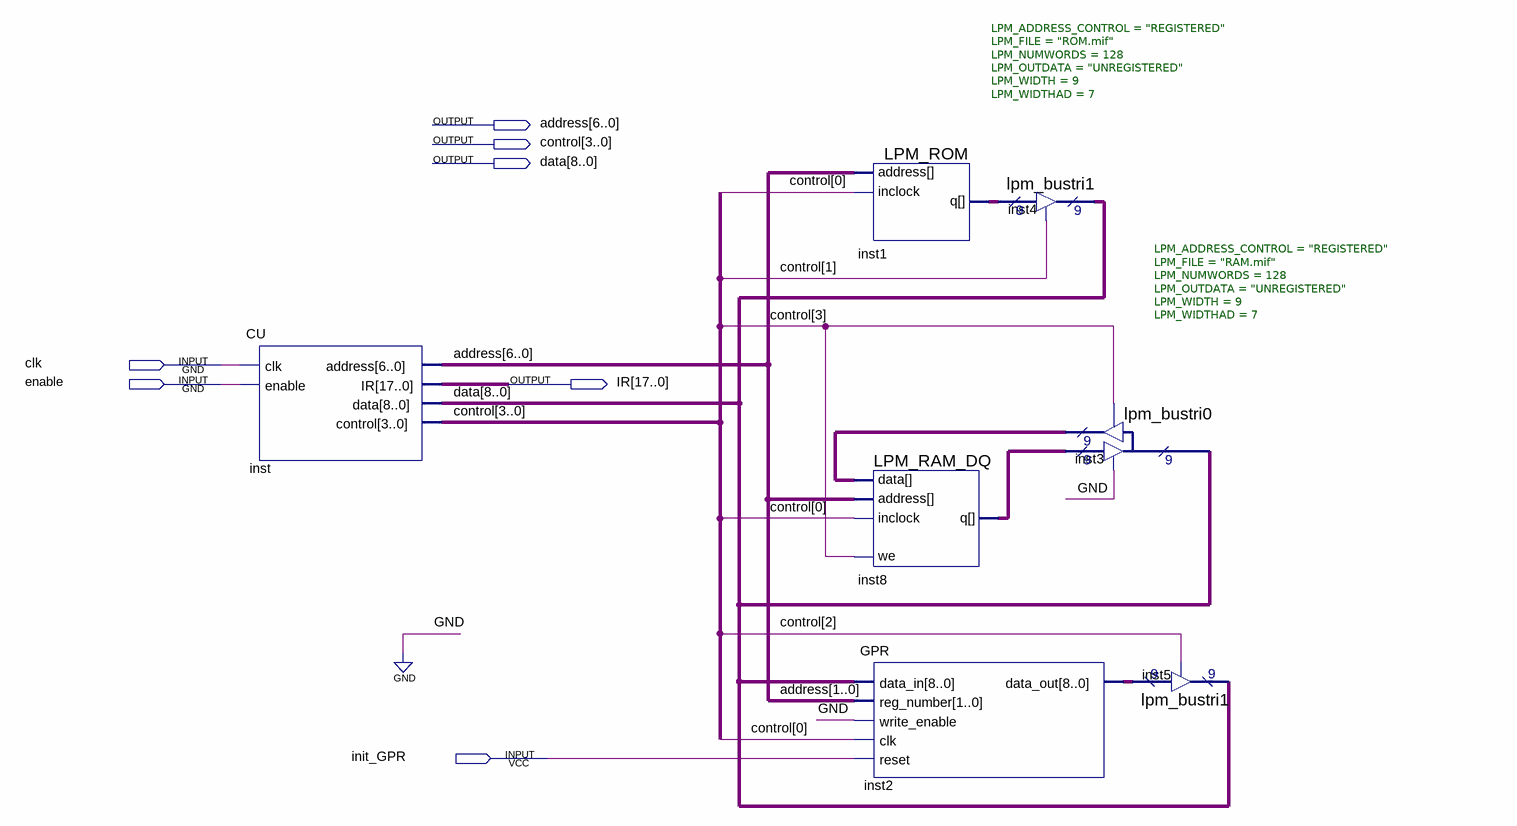
[diagram p0: schematic sheet]
// Quartus schematic Lab_4.bdf as structural Verilog: 7 symbols, 7 pins
module Lab_4 (
  input  clk,
  input  enable,
  input  init_GPR,
  output [6:0] address,
  output [3:0] control,
  output [8:0] data,
  output [17:0] IR
);

  wire [8:0] inst1_q, inst2_data_out, inst3_result, inst8_q;

  CU inst (.clk(clk), .enable(enable), .address(address), .IR(IR), .control(control), .data(data));
  LPM_ROM #(.LPM_ADDRESS_CONTROL("REGISTERED"), .LPM_FILE("ROM.mif"), .LPM_NUMWORDS(128), .LPM_OUTDATA("UNREGISTERED"), .LPM_WIDTH(9), .LPM_WIDTHAD(7)) inst1 (
    .address(address), .inclock(control[0]), .q(inst1_q));
  LPM_RAM_DQ #(.LPM_ADDRESS_CONTROL("REGISTERED"), .LPM_FILE("RAM.mif"), .LPM_NUMWORDS(128), .LPM_OUTDATA("UNREGISTERED"), .LPM_WIDTH(9), .LPM_WIDTHAD(7)) inst8 (
    .inclock(control[0]), .data(inst3_result), .address(address), .we(control[3]), .q(inst8_q));
  GPR inst2 (
    .data_in(data), .reg_number(address[1:0]), .write_enable(1'b0), .clk(control[0]), .reset(init_GPR),
    .data_out(inst2_data_out));
  lpm_bustri1 inst4 (.enabledt(control[1]), .data(inst1_q), .tridata(data));
  lpm_bustri0 inst3 (.enabledt(1'b0), .data(inst8_q), .enabletr(control[3]), .result(inst3_result), .tridata(data));
  lpm_bustri1 inst5 (.enabledt(control[2]), .data(inst2_data_out), .tridata(data));
endmodule
